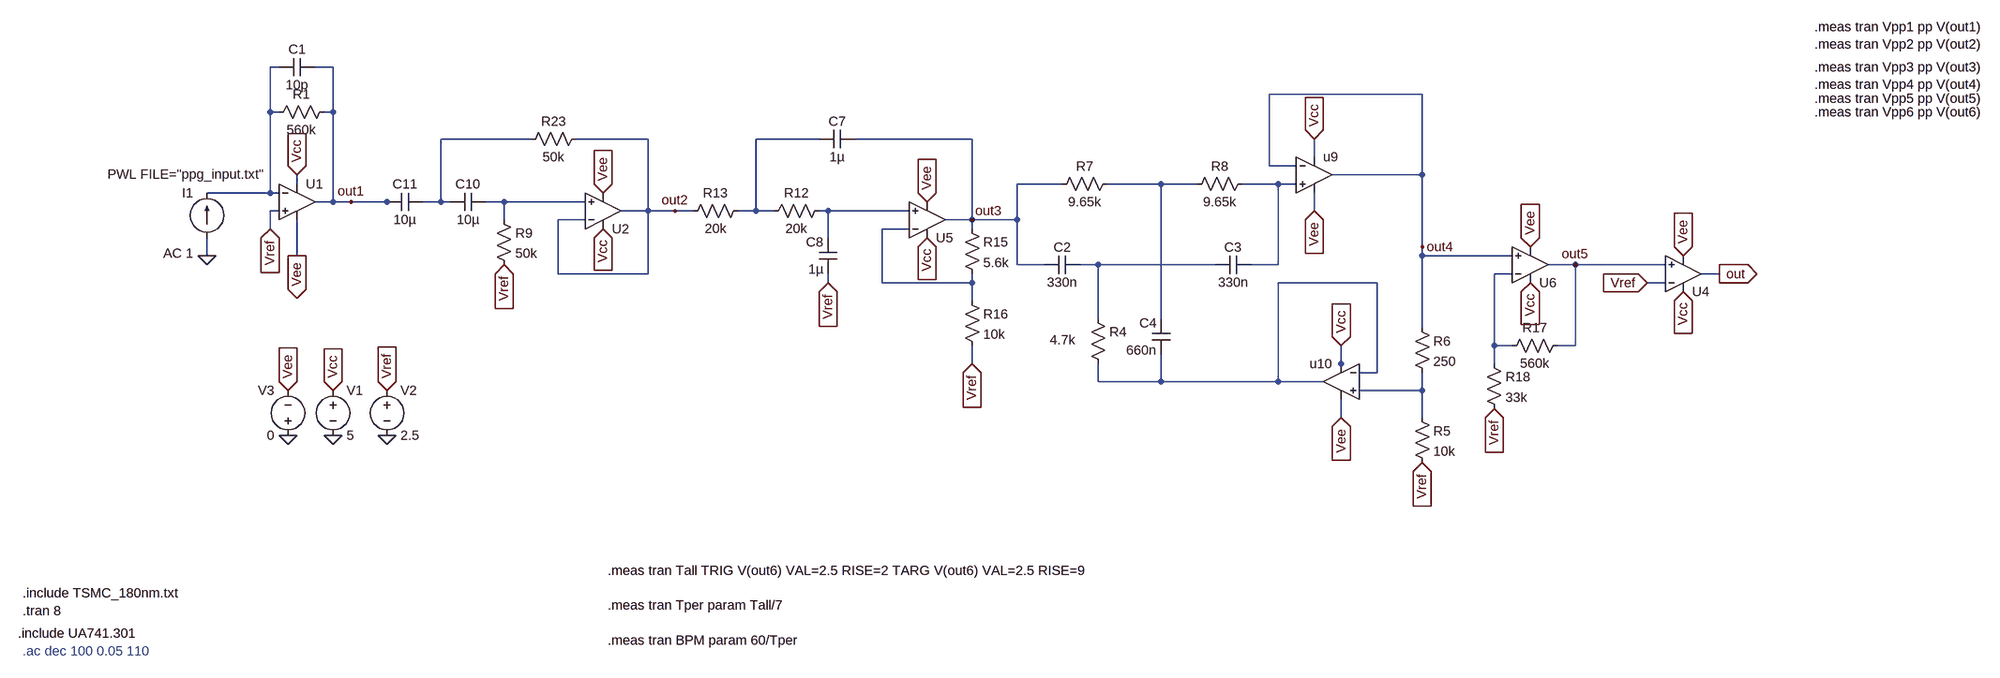
[diagram p0: schematic FinalCkt.asc]
FinalCkt.asc, the LTspice schematic file:
Version 4
SHEET 1 4772 1016
WIRE -1680 -192 -1696 -192
WIRE -1584 -192 -1616 -192
WIRE 352 -144 80 -144
WIRE -1696 -112 -1696 -192
WIRE -1680 -112 -1696 -112
WIRE -1584 -112 -1584 -192
WIRE -1584 -112 -1600 -112
WIRE -1232 -64 -1392 -64
WIRE -1024 -64 -1152 -64
WIRE -720 -64 -832 -64
WIRE -448 -64 -656 -64
WIRE 160 -32 160 -64
WIRE 80 -16 80 -144
WIRE 128 -16 80 -16
WIRE 352 0 352 -144
WIRE 352 0 192 0
WIRE -1648 16 -1648 0
WIRE -288 16 -368 16
WIRE -112 16 -208 16
WIRE -48 16 -112 16
WIRE 96 16 32 16
WIRE 128 16 96 16
WIRE -1696 32 -1696 -112
WIRE -1696 32 -1808 32
WIRE -1680 32 -1696 32
WIRE -1584 48 -1584 -112
WIRE -1584 48 -1616 48
WIRE -1552 48 -1584 48
WIRE -1488 48 -1552 48
WIRE -1472 48 -1488 48
WIRE -1392 48 -1392 -64
WIRE -1392 48 -1424 48
WIRE -1376 48 -1392 48
WIRE -1280 48 -1312 48
WIRE -1136 48 -1280 48
WIRE -1680 64 -1696 64
WIRE -1024 64 -1024 -64
WIRE -1024 64 -1072 64
WIRE -976 64 -1024 64
WIRE -944 64 -976 64
WIRE -832 64 -832 -64
WIRE -832 64 -864 64
WIRE -800 64 -832 64
WIRE -704 64 -720 64
WIRE -560 64 -704 64
WIRE 160 64 160 32
WIRE -1280 80 -1280 48
WIRE -1136 80 -1184 80
WIRE -448 80 -448 -64
WIRE -448 80 -496 80
WIRE -368 80 -368 16
WIRE -368 80 -448 80
WIRE -1696 96 -1696 64
WIRE -560 96 -608 96
WIRE -448 96 -448 80
WIRE -704 112 -704 64
WIRE 352 128 352 0
WIRE -1808 144 -1808 112
WIRE -1648 144 -1648 80
WIRE 352 144 352 128
WIRE 512 144 352 144
WIRE -368 160 -368 80
WIRE -320 160 -368 160
WIRE -224 160 -256 160
WIRE -16 160 -224 160
WIRE 96 160 96 16
WIRE 96 160 48 160
WIRE 624 160 576 160
WIRE 784 160 624 160
WIRE -1184 176 -1184 80
WIRE -1024 176 -1024 64
WIRE -1024 176 -1184 176
WIRE 512 176 480 176
WIRE 880 176 848 176
WIRE -704 192 -704 176
WIRE -608 192 -608 96
WIRE -448 192 -448 176
WIRE -448 192 -608 192
WIRE 272 192 96 192
WIRE 784 192 752 192
WIRE -448 224 -448 192
WIRE -224 256 -224 160
WIRE -112 256 -112 16
WIRE 352 272 352 144
WIRE 480 304 480 176
WIRE 512 304 480 304
WIRE 624 304 624 160
WIRE 624 304 592 304
WIRE -448 336 -448 304
WIRE 208 336 208 304
WIRE 480 336 480 304
WIRE 208 352 208 336
WIRE 272 352 272 192
WIRE 272 352 240 352
WIRE -224 368 -224 336
WIRE -112 368 -112 320
WIRE -112 368 -224 368
WIRE 96 368 96 192
WIRE 96 368 -112 368
WIRE 176 368 96 368
WIRE 352 384 352 352
WIRE 352 384 240 384
WIRE 208 432 208 400
WIRE 352 432 352 384
FLAG -1808 144 0
FLAG -1584 464 0
FLAG -1648 0 Vcc
IOPIN -1648 0 In
FLAG -1488 464 0
FLAG -1104 96 Vcc
IOPIN -1104 96 In
FLAG -1664 464 0
FLAG -1664 384 Vee
IOPIN -1664 384 In
FLAG -1104 32 Vee
IOPIN -1104 32 In
FLAG -1648 144 Vee
IOPIN -1648 144 Out
FLAG -1552 48 out1
FLAG 352 128 out4
FLAG -528 112 Vcc
IOPIN -528 112 In
FLAG -528 48 Vee
IOPIN -528 48 In
FLAG 352 512 Vref
IOPIN 352 512 In
FLAG 160 -64 Vcc
IOPIN 160 -64 In
FLAG 208 304 Vcc
IOPIN 208 304 In
FLAG 160 64 Vee
IOPIN 160 64 In
FLAG 208 432 Vee
IOPIN 208 432 In
FLAG -1696 96 Vref
IOPIN -1696 96 In
FLAG -704 192 Vref
IOPIN -704 192 In
FLAG -448 336 Vref
IOPIN -448 336 In
FLAG 544 192 Vcc
IOPIN 544 192 In
FLAG 544 128 Vee
IOPIN 544 128 In
FLAG 624 160 out5
FLAG -1584 384 Vcc
IOPIN -1584 384 In
FLAG -1488 384 Vref
IOPIN -1488 384 In
FLAG -1280 160 Vref
IOPIN -1280 160 In
FLAG -448 80 out3
FLAG 752 192 Vref
IOPIN 752 192 In
FLAG 816 208 Vcc
IOPIN 816 208 In
FLAG 816 144 Vee
IOPIN 816 144 In
FLAG 880 176 out
IOPIN 880 176 Out
FLAG 480 416 Vref
IOPIN 480 416 In
FLAG -976 64 out2
SYMBOL current -1808 112 R180
WINDOW 0 24 80 Left 2
WINDOW 3 -102 113 Left 2
WINDOW 123 24 -28 Left 2
WINDOW 39 0 0 Left 0
SYMATTR InstName I1
SYMATTR Value PWL FILE="ppg_input.txt"
SYMATTR Value2 AC 1
SYMBOL voltage -1584 368 R0
SYMATTR InstName V1
SYMATTR Value 5
SYMBOL res -1584 -128 R90
WINDOW 0 0 56 VBottom 2
WINDOW 3 32 56 VTop 2
SYMATTR InstName R1
SYMATTR Value 560k
SYMBOL cap -1616 -208 R90
WINDOW 0 0 32 VBottom 2
WINDOW 3 32 32 VTop 2
SYMATTR InstName C1
SYMATTR Value 10p
SYMBOL OpAmps\\UniversalOpAmp2 -1648 48 R0
SYMATTR InstName U1
SYMBOL voltage -1488 368 R0
WINDOW 123 0 0 Left 0
WINDOW 39 0 0 Left 0
SYMATTR InstName V2
SYMATTR Value 2.5
SYMBOL OpAmps\\UniversalOpAmp2 -1104 64 M180
SYMATTR InstName U2
SYMBOL voltage -1664 480 R180
WINDOW 0 24 96 Left 2
WINDOW 3 24 16 Left 2
WINDOW 123 0 0 Left 0
WINDOW 39 0 0 Left 0
SYMATTR InstName V3
SYMATTR Value 0
SYMBOL cap -256 144 R90
WINDOW 0 0 32 VBottom 2
WINDOW 3 32 32 VTop 2
SYMATTR InstName C2
SYMATTR Value 330n
SYMBOL cap 48 144 R90
WINDOW 0 0 32 VBottom 2
WINDOW 3 32 32 VTop 2
SYMATTR InstName C3
SYMATTR Value 330n
SYMBOL cap -96 320 R180
WINDOW 0 24 56 Left 2
WINDOW 3 24 8 Left 2
SYMATTR InstName C4
SYMATTR Value 660n
SYMBOL res -240 240 R0
WINDOW 3 -70 54 Left 2
SYMATTR Value 4.7k
SYMATTR InstName R4
SYMBOL res 336 416 R0
SYMATTR InstName R5
SYMATTR Value 10k
SYMBOL res 336 256 R0
SYMATTR InstName R6
SYMATTR Value 250
SYMBOL res -192 0 R90
WINDOW 0 0 56 VBottom 2
WINDOW 3 32 56 VTop 2
SYMATTR InstName R7
SYMATTR Value 9.65k
SYMBOL res 48 0 R90
WINDOW 0 0 56 VBottom 2
WINDOW 3 32 56 VTop 2
SYMATTR InstName R8
SYMATTR Value 9.65k
SYMBOL OpAmps\\UniversalOpAmp2 160 0 R0
SYMATTR InstName u9
SYMBOL OpAmps\\UniversalOpAmp2 208 368 M0
SYMATTR InstName u10
SYMBOL OpAmps\\UniversalOpAmp2 -528 80 M180
SYMATTR InstName U5
SYMBOL res -464 80 R0
SYMATTR InstName R15
SYMATTR Value 5.6k
SYMBOL res -464 208 R0
SYMATTR InstName R16
SYMATTR Value 10k
SYMBOL OpAmps\\UniversalOpAmp2 544 160 M180
SYMATTR InstName U6
SYMBOL res 608 288 R90
WINDOW 0 0 56 VBottom 2
WINDOW 3 32 56 VTop 2
SYMATTR InstName R17
SYMATTR Value 560k
SYMBOL res 464 320 R0
SYMATTR InstName R18
SYMATTR Value 33k
SYMBOL res -704 48 R90
WINDOW 0 0 56 VBottom 2
WINDOW 3 32 56 VTop 2
SYMATTR InstName R12
SYMATTR Value 20k
SYMBOL res -848 48 R90
WINDOW 0 0 56 VBottom 2
WINDOW 3 32 56 VTop 2
SYMATTR InstName R13
SYMATTR Value 20k
SYMBOL cap -688 176 R180
WINDOW 0 24 56 Left 2
WINDOW 3 24 8 Left 2
SYMATTR InstName C8
SYMATTR Value 1µ
SYMBOL res -1296 64 R0
SYMATTR InstName R9
SYMATTR Value 50k
SYMBOL res -1136 -80 R90
WINDOW 0 0 56 VBottom 2
WINDOW 3 32 56 VTop 2
SYMATTR InstName R23
SYMATTR Value 50k
SYMBOL cap -1424 32 R90
WINDOW 0 0 32 VBottom 2
WINDOW 3 32 32 VTop 2
SYMATTR InstName C11
SYMATTR Value 10µ
SYMBOL cap -1312 32 R90
WINDOW 0 0 32 VBottom 2
WINDOW 3 32 32 VTop 2
SYMATTR InstName C10
SYMATTR Value 10µ
SYMBOL cap -656 -80 R90
WINDOW 0 0 32 VBottom 2
WINDOW 3 32 32 VTop 2
SYMATTR InstName C7
SYMATTR Value 1µ
SYMBOL OpAmps\\UniversalOpAmp2 816 176 M180
SYMATTR InstName U4
TEXT -2144 968 Left 2 !.include UA741.301
TEXT -2136 928 Left 2 !.tran 8
TEXT -2136 896 Left 2 !.include TSMC_180nm.txt
TEXT -2136 1000 Left 2 ;.ac dec 100 0.05 110
TEXT 2088 -264 Left 2 !.meas tran Vpp1 pp V(out1)\n.meas tran Vpp2 pp V(out2)
TEXT 2088 -192 Left 2 !.meas tran Vpp3 pp V(out3)\n.meas tran Vpp4 pp V(out4)
TEXT 2088 -136 Left 2 !.meas tran Vpp5 pp V(out5)
TEXT 2088 -112 Left 2 !.meas tran Vpp6 pp V(out6)
TEXT -1096 856 Left 2 !.meas tran Tall TRIG V(out6) VAL=2.5 RISE=2 TARG V(out6) VAL=2.5 RISE=9\n \n.meas tran Tper param Tall/7\n \n.meas tran BPM param 60/Tper

The netlist it stands for:
* FinalCkt.asc
I1 0 N001 PWL FILE="ppg_input.txt" AC 1
V1 Vcc 0 5
R1 out1 N001 560k
C1 out1 N001 10p
XU1 Vref N001 Vcc Vee out1 level2 Avol=1Meg GBW=10Meg Slew=10Meg Ilimit=25m Rail=0 Vos=0 En=0 Enk=0 In=0 Ink=0 Rin=500Meg  ; pins In+ In- V+ V- OUT
V2 Vref 0 2.5
XU2 N006 out2 Vcc Vee out2 level2 Avol=1Meg GBW=10Meg Slew=10Meg Ilimit=25m Rail=0 Vos=0 En=0 Enk=0 In=0 Ink=0 Rin=500Meg  ; pins In+ In- V+ V- OUT
V3 0 Vee 0
C2 N009 out3 330n
C3 N005 N009 330n
C4 N011 N004 660n
R4 N009 N011 4.7k
R5 N012 Vref 10k
R6 out4 N012 250
R7 N004 out3 9.65k
R8 N005 N004 9.65k
Xu9 N005 out4 Vcc Vee out4 level2 Avol=1Meg GBW=10Meg Slew=10Meg Ilimit=25m Rail=0 Vos=0 En=0 Enk=0 In=0 Ink=0 Rin=500Meg  ; pins In+ In- V+ V- OUT
Xu10 N012 N011 Vcc Vee N011 level2 Avol=1Meg GBW=10Meg Slew=10Meg Ilimit=25m Rail=0 Vos=0 En=0 Enk=0 In=0 Ink=0 Rin=500Meg  ; pins In+ In- V+ V- OUT
XU5 N007 N008 Vcc Vee out3 level2 Avol=1Meg GBW=10Meg Slew=10Meg Ilimit=25m Rail=0 Vos=0 En=0 Enk=0 In=0 Ink=0 Rin=500Meg  ; pins In+ In- V+ V- OUT
R15 out3 N008 5.6k
R16 N008 Vref 10k
XU6 out4 N010 Vcc Vee out5 level2 Avol=1Meg GBW=10Meg Slew=10Meg Ilimit=25m Rail=0 Vos=0 En=0 Enk=0 In=0 Ink=0 Rin=500Meg  ; pins In+ In- V+ V- OUT
R17 out5 N010 560k
R18 N010 Vref 33k
R12 N007 N003 20k
R13 N003 out2 20k
C8 Vref N007 1µ
R9 N006 Vref 50k
R23 out2 N002 50k
C11 N002 out1 10µ
C10 N006 N002 10µ
C7 out3 N003 1µ
XU4 out5 Vref Vcc Vee out level2 Avol=1Meg GBW=10Meg Slew=10Meg Ilimit=25m Rail=0 Vos=0 En=0 Enk=0 In=0 Ink=0 Rin=500Meg  ; pins In+ In- V+ V- OUT
.include UA741.301
.tran 8
.include TSMC_180nm.txt
* .ac dec 100 0.05 110
.meas tran Vpp1 pp V(out1)
.meas tran Vpp2 pp V(out2)
.meas tran Vpp3 pp V(out3)
.meas tran Vpp4 pp V(out4)
.meas tran Vpp5 pp V(out5)
.meas tran Vpp6 pp V(out6)
.meas tran Tall TRIG V(out6) VAL=2.5 RISE=2 TARG V(out6) VAL=2.5 RISE=9
.meas tran Tper param Tall/7
.meas tran BPM param 60/Tper
.lib UniversalOpAmp2.lib
.backanno
.end